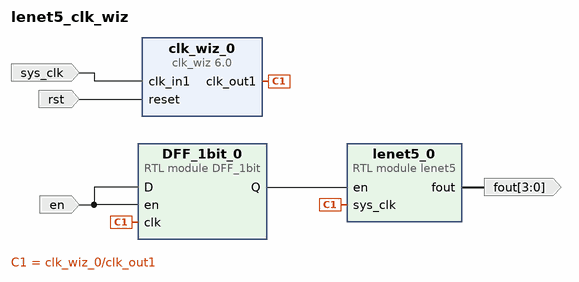
[diagram p0: block diagram of the top level]
# Vivado block design lenet5_clk_wiz, xc7z020clg400-1, Vivado 2018.2
create_bd_design lenet5_clk_wiz

create_bd_port -dir I en
create_bd_port -dir I -type clk sys_clk
set_property -dict {CONFIG.FREQ_HZ 100000000} [get_bd_ports sys_clk]
create_bd_port -dir I -type rst rst
set_property -dict {CONFIG.POLARITY ACTIVE_HIGH} [get_bd_ports rst]
create_bd_port -dir O -from 3 -to 0 fout

create_bd_cell -type ip -vlnv xilinx.com:ip:clk_wiz:6.0 clk_wiz_0
set_property -dict [list \
  CONFIG.CLKIN1_JITTER_PS 80.0 \
  CONFIG.CLKOUT1_REQUESTED_OUT_FREQ 100 \
  CONFIG.MMCM_DIVCLK_DIVIDE 1 \
  CONFIG.MMCM_CLKFBOUT_MULT_F 8.000 \
  CONFIG.MMCM_CLKIN1_PERIOD 8.000 \
  CONFIG.MMCM_CLKOUT0_DIVIDE_F 10.000 \
  CONFIG.CLK_IN1_BOARD_INTERFACE sys_clock \
  CONFIG.CLKOUT1_JITTER 124.615 \
  CONFIG.CLKOUT1_PHASE_ERROR 96.948 \
] [get_bd_cells clk_wiz_0]
create_bd_cell -type module -reference DFF_1bit DFF_1bit_0
create_bd_cell -type module -reference lenet5 lenet5_0

# ---- connections ----

connect_bd_net [get_bd_pins clk_wiz_0/clk_out1] [get_bd_pins DFF_1bit_0/clk] [get_bd_pins lenet5_0/sys_clk]
connect_bd_net [get_bd_pins DFF_1bit_0/Q] [get_bd_pins lenet5_0/en]
connect_bd_net [get_bd_ports en] [get_bd_pins DFF_1bit_0/en] [get_bd_pins DFF_1bit_0/D]
connect_bd_net [get_bd_ports sys_clk] [get_bd_pins clk_wiz_0/clk_in1]
connect_bd_net -net reset_1 [get_bd_ports rst] [get_bd_pins clk_wiz_0/reset]
connect_bd_net [get_bd_pins lenet5_0/fout] [get_bd_ports fout]

validate_bd_design
save_bd_design
